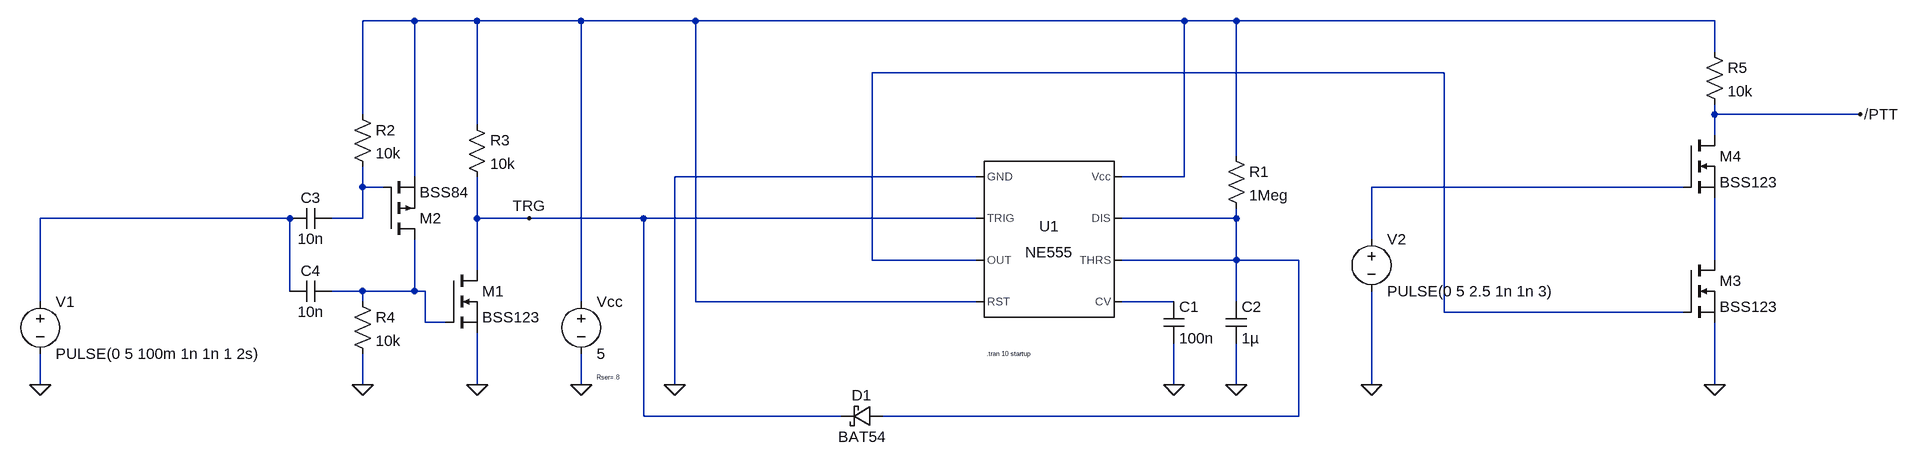
[diagram p0: schematic 555Monostable_retriggerable_timer.asc]
555Monostable_retriggerable_timer.asc, the LTspice schematic file:
Version 4
SHEET 1 1420 680
WIRE -880 -80 -960 -80
WIRE -784 -80 -880 -80
WIRE -624 -80 -784 -80
WIRE -448 -80 -624 -80
WIRE 304 -80 -448 -80
WIRE 384 -80 304 -80
WIRE 1120 -80 384 -80
WIRE 1120 -32 1120 -80
WIRE 704 0 -176 0
WIRE -960 64 -960 -80
WIRE 1120 64 1120 48
WIRE 1344 64 1120 64
WIRE -784 80 -784 -80
WIRE 1120 96 1120 64
WIRE 384 128 384 -80
WIRE -880 160 -880 -80
WIRE -16 160 -480 160
WIRE 304 160 304 -80
WIRE 304 160 208 160
WIRE -960 176 -960 144
WIRE -928 176 -960 176
WIRE 1072 176 592 176
WIRE -1072 224 -1456 224
WIRE -960 224 -960 176
WIRE -960 224 -1008 224
WIRE -784 224 -784 160
WIRE -704 224 -784 224
WIRE -528 224 -704 224
WIRE -16 224 -528 224
WIRE 384 224 384 208
WIRE 384 224 208 224
WIRE 592 256 592 176
WIRE -176 288 -176 0
WIRE -16 288 -176 288
WIRE 384 288 384 224
WIRE 384 288 208 288
WIRE 480 288 384 288
WIRE 1120 288 1120 192
WIRE -784 304 -784 224
WIRE -1072 336 -1072 224
WIRE -960 336 -1008 336
WIRE -880 336 -880 256
WIRE -880 336 -960 336
WIRE -864 336 -880 336
WIRE -1456 352 -1456 224
WIRE -960 352 -960 336
WIRE -624 352 -624 -80
WIRE -448 352 -448 -80
WIRE -16 352 -448 352
WIRE 288 352 208 352
WIRE 384 352 384 288
WIRE 704 368 704 0
WIRE 1072 368 704 368
WIRE -864 384 -864 336
WIRE -832 384 -864 384
WIRE -1456 480 -1456 432
WIRE -960 480 -960 432
WIRE -784 480 -784 400
WIRE -624 480 -624 432
WIRE -480 480 -480 160
WIRE 288 480 288 416
WIRE 384 480 384 416
WIRE 592 480 592 336
WIRE 1120 480 1120 384
WIRE -528 528 -528 224
WIRE -224 528 -528 528
WIRE 480 528 480 288
WIRE 480 528 -160 528
FLAG -480 480 0
FLAG 288 480 0
FLAG 384 480 0
FLAG -624 480 0
FLAG -1456 480 0
FLAG -960 480 0
FLAG -784 480 0
FLAG -704 224 TRG
FLAG 1120 480 0
FLAG 592 480 0
FLAG 1344 64 /PTT
SYMBOL Misc\\NE555 96 256 R0
SYMATTR InstName U1
SYMBOL cap 272 352 R0
SYMATTR InstName C1
SYMATTR Value 100n
SYMBOL res 368 112 R0
SYMATTR InstName R1
SYMATTR Value 1Meg
SYMATTR SpiceLine tol=1 pwr=0.1
SYMBOL cap 368 352 R0
SYMATTR InstName C2
SYMATTR Value 1µ
SYMATTR SpiceLine V=25 Irms=0 Rser=0.007 MTBF=0 Lser=0 ppPkg=1
SYMBOL voltage -624 336 R0
WINDOW 123 0 0 Left 0
WINDOW 39 24 132 Left 0
SYMATTR SpiceLine Rser=.8
SYMATTR InstName Vcc
SYMATTR Value 5
SYMBOL voltage -1456 336 R0
WINDOW 123 0 0 Left 0
WINDOW 39 0 0 Left 0
SYMATTR InstName V1
SYMATTR Value PULSE(0 5 100m 1n 1n 1 2s)
SYMBOL cap -1008 208 R90
WINDOW 0 0 32 VBottom 2
WINDOW 3 32 32 VTop 2
SYMATTR InstName C3
SYMATTR Value 10n
SYMBOL res -976 48 R0
SYMATTR InstName R2
SYMATTR Value 10k
SYMBOL nmos -832 304 R0
SYMATTR InstName M1
SYMATTR Value BSS123
SYMBOL cap -1008 320 R90
WINDOW 0 0 32 VBottom 2
WINDOW 3 32 32 VTop 2
SYMATTR InstName C4
SYMATTR Value 10n
SYMBOL res -976 336 R0
SYMATTR InstName R4
SYMATTR Value 10k
SYMBOL pmos -928 256 M180
SYMATTR InstName M2
SYMATTR Value BSS84
SYMBOL res -800 64 R0
SYMATTR InstName R3
SYMATTR Value 10k
SYMBOL schottky -160 512 R90
WINDOW 0 0 32 VBottom 2
WINDOW 3 32 32 VTop 2
SYMATTR InstName D1
SYMATTR Value BAT54
SYMATTR Description Diode
SYMATTR Type diode
SYMBOL nmos 1072 288 R0
SYMATTR InstName M3
SYMATTR Value BSS123
SYMBOL nmos 1072 96 R0
SYMATTR InstName M4
SYMATTR Value BSS123
SYMBOL voltage 592 240 R0
WINDOW 123 0 0 Left 0
WINDOW 39 0 0 Left 0
SYMATTR InstName V2
SYMATTR Value PULSE(0 5 2.5 1n 1n 3)
SYMBOL res 1104 -48 R0
SYMATTR InstName R5
SYMATTR Value 10k
TEXT 0 432 Left 0 !.tran 10 startup

The netlist it stands for:
* 555Monostable_retriggerable_timer.asc
XU1 0 TRG N002 N001 N009 N006 N006 N001 NE555  ; pins GND TRIG OUT RST CV THRS DIS Vcc
C1 N009 0 100n
R1 N001 N006 1Meg tol=1 pwr=0.1
C2 N006 0 1µ V=25 Irms=0 Rser=0.007 MTBF=0 Lser=0 ppPkg=1
Vcc N001 0 5 Rser=.8
V1 N005 0 PULSE(0 5 100m 1n 1n 1 2s)
C3 N003 N005 10n
R2 N001 N003 10k
M1 TRG N008 0 0 BSS123
C4 N008 N005 10n
R4 N008 0 10k
M2 N008 N003 N001 N001 BSS84
R3 N001 TRG 10k
D1 N006 TRG BAT54
M3 N007 N002 0 0 BSS123
M4 /PTT N004 N007 N007 BSS123
V2 N004 0 PULSE(0 5 2.5 1n 1n 3)
R5 N001 /PTT 10k
.model D D
.lib standard.dio
.model NMOS NMOS
.model PMOS PMOS
.lib standard.mos
.tran 10 startup
.lib NE555.sub
.backanno
.end